# Altium schematic sheet PowerSupply.SchDoc
size A4
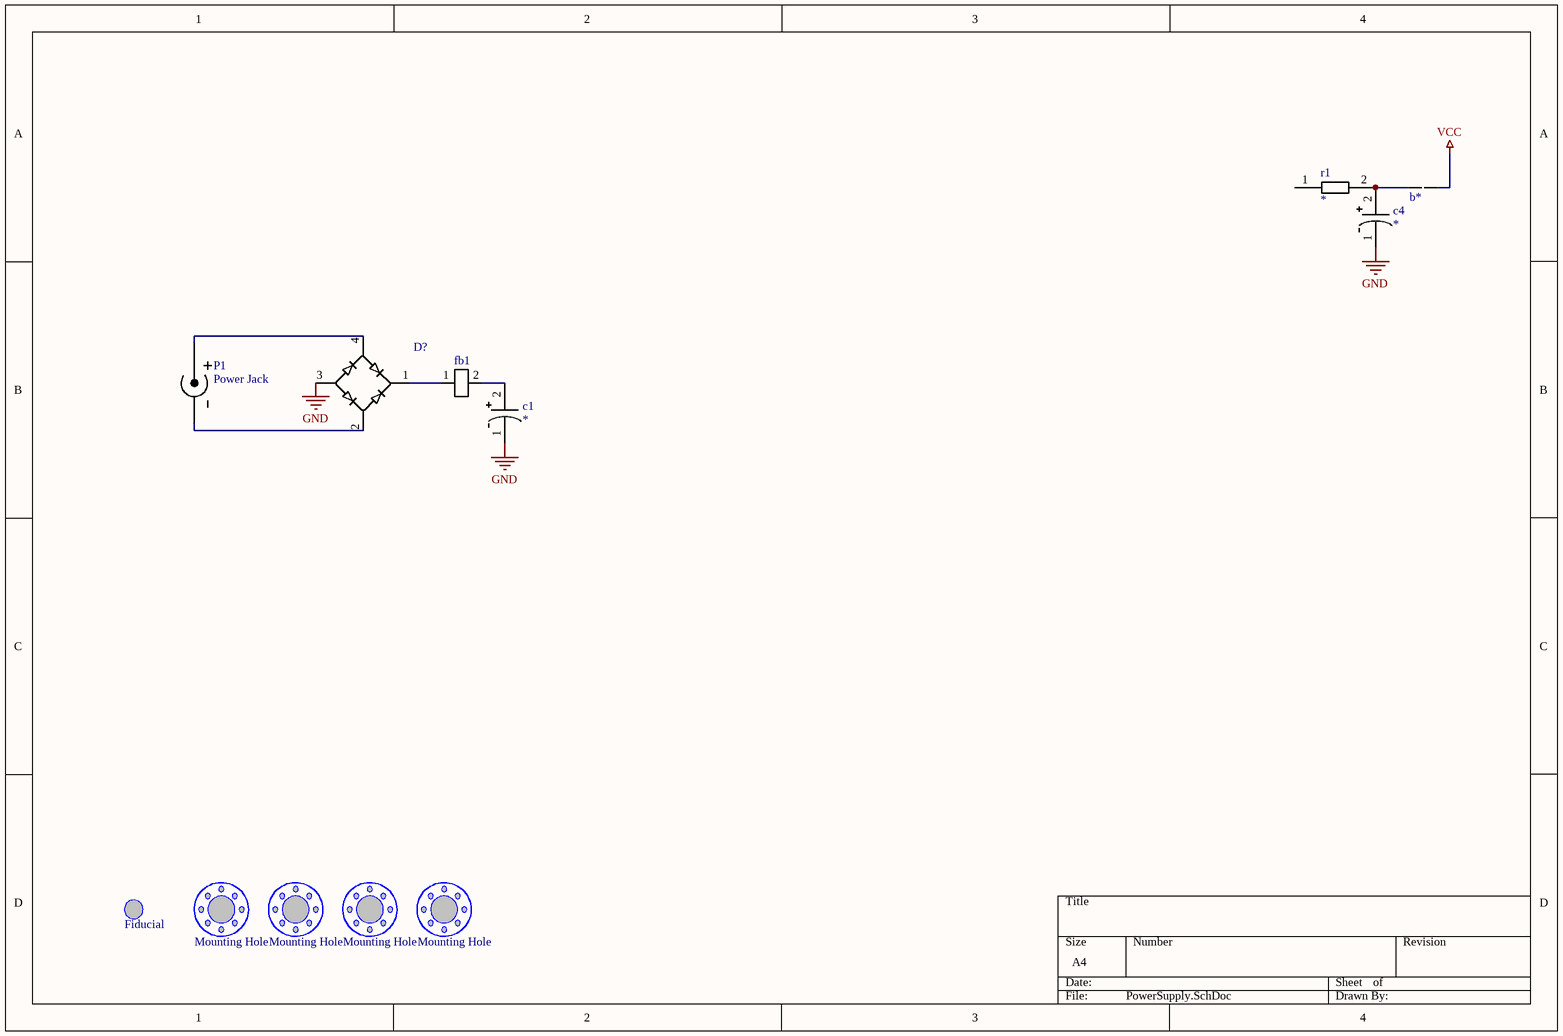
[diagram p0: PowerSupply.SchDoc]

## Parts
(Parts that share a designator on the sheet are numbered #1, #2 ... from top to bottom, then left to right.)
b*  Solder Bridge  [Solder Bridge]  (value not drawn)
c1  *  [Elco-D]
c4  *  [Elco-D]
D?  Bridge Rectifier  [SOT-143]  (value not drawn)
f*  Fiducial  [Fiducial]
fb1  *  [0805]  (value not drawn)
H*  Mounting Hole  [Mounting Hole]
H*?#1  Mounting Hole  [Mounting Hole]
H*?#2  Mounting Hole  [Mounting Hole]
H*?#3  Mounting Hole  [Mounting Hole]
P1  Power Jack  [Power Jack]
r1  *  [0805]

## Nets
GND: c1.1 c4.1 D?.3
VCC: b*.2
Netb*_1: b*.1 c4.2 r1.2
Netc1_2: c1.2 fb1.2
NetD?_1: D?.1 fb1.1
NetD?_2: D?.2 P1.2(GND)
NetD?_4: D?.4 P1.1(V+)

Not connected (* = marked no-connect by the designer): r1 1

## Library data of the parts
c1 c4 = Elco D: Elco size D 6.3x5.4
fb1 = Ferrite Bead 0805 Package: Ferrite Bead
P1 = DC Power Jack
r1 = 0805 Resistor: 0805 Resistor package